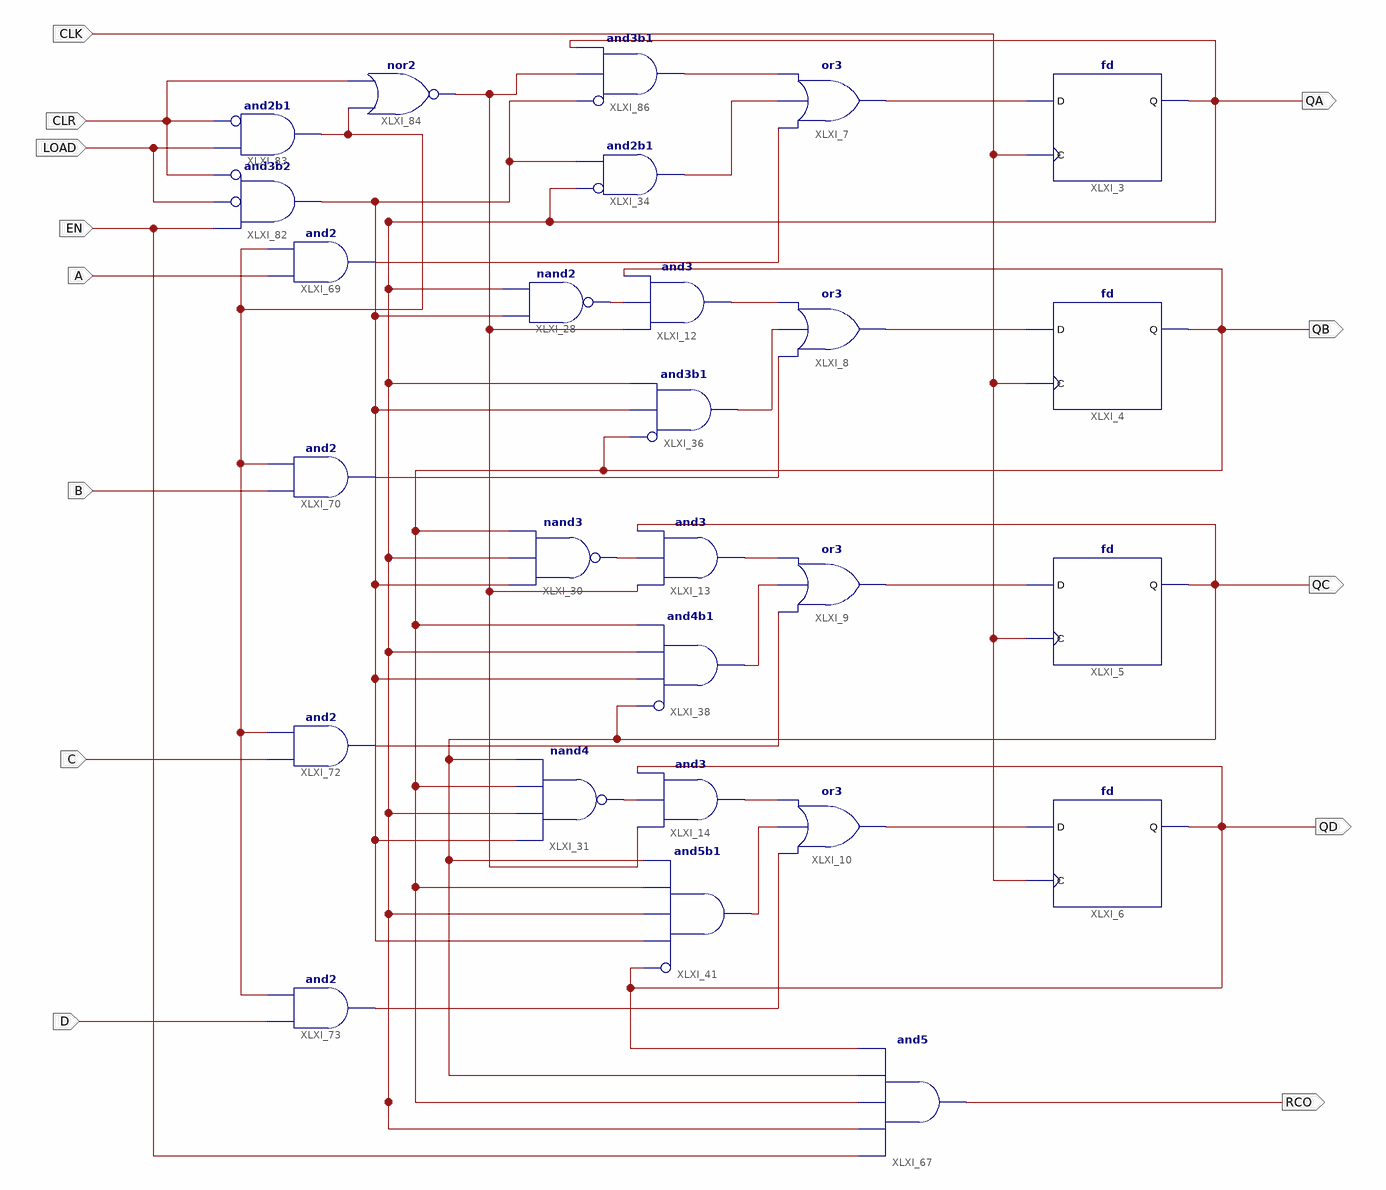
[diagram p0: schematic sheet 1]
// Xilinx ISE schematic counter163.sch (spartan3e) as structural Verilog: 27 symbols, 13 ports
module counter163 (
  input  A,
  input  B,
  input  C,
  input  D,
  input  EN,
  input  LOAD,
  input  CLR,
  input  CLK,
  output QC,
  output QD,
  output QA,
  output QB,
  output RCO
);

  wire XLXN_1, XLXN_2, XLXN_3, XLXN_4, XLXN_5, XLXN_6, XLXN_7, XLXN_8, XLXN_13, XLXN_14, XLXN_15, XLXN_64,
       XLXN_65, XLXN_67, XLXN_68, XLXN_76, XLXN_106, XLXN_107, XLXN_108, XLXN_111, XLXN_113, XLXN_134;

  fd XLXI_3 (.C(CLK), .D(XLXN_1), .Q(QA));
  fd XLXI_4 (.C(CLK), .D(XLXN_2), .Q(QB));
  or XLXI_7 (XLXN_1, XLXN_64, XLXN_6, XLXN_5);
  or XLXI_8 (XLXN_2, XLXN_65, XLXN_8, XLXN_7);
  and XLXI_12 (XLXN_7, XLXN_134, XLXN_13, QB);
  nand XLXI_28 (XLXN_13, XLXN_111, QA);
  and XLXI_34 (XLXN_6, ~QA, XLXN_111);  // and2b1
  and XLXI_36 (XLXN_8, ~QB, XLXN_111, QA);  // and3b1
  fd XLXI_5 (.C(CLK), .D(XLXN_3), .Q(QC));
  or XLXI_9 (XLXN_3, XLXN_67, XLXN_107, XLXN_106);
  and XLXI_13 (XLXN_106, XLXN_134, XLXN_14, QC);
  nand XLXI_30 (XLXN_14, XLXN_111, QA, QB);
  and XLXI_38 (XLXN_107, ~QC, XLXN_111, QA, QB);  // and4b1
  and XLXI_67 (RCO, EN, QA, QB, QC, QD);
  and XLXI_69 (XLXN_64, A, XLXN_113);
  and XLXI_70 (XLXN_65, B, XLXN_113);
  and XLXI_72 (XLXN_67, C, XLXN_113);
  and XLXI_73 (XLXN_68, D, XLXN_113);
  nand XLXI_31 (XLXN_15, XLXN_111, QA, QB, QC);
  and XLXI_41 (XLXN_76, ~QD, XLXN_111, QA, QB, QC);  // and5b1
  and XLXI_14 (XLXN_108, XLXN_134, XLXN_15, QD);
  or XLXI_10 (XLXN_4, XLXN_68, XLXN_76, XLXN_108);
  fd XLXI_6 (.C(CLK), .D(XLXN_4), .Q(QD));
  and XLXI_82 (XLXN_111, ~CLR, ~LOAD, EN);  // and3b2
  and XLXI_83 (XLXN_113, ~CLR, LOAD);  // and2b1
  nor XLXI_84 (XLXN_134, XLXN_113, CLR);
  and XLXI_86 (XLXN_5, ~XLXN_111, XLXN_134, QA);  // and3b1
endmodule
